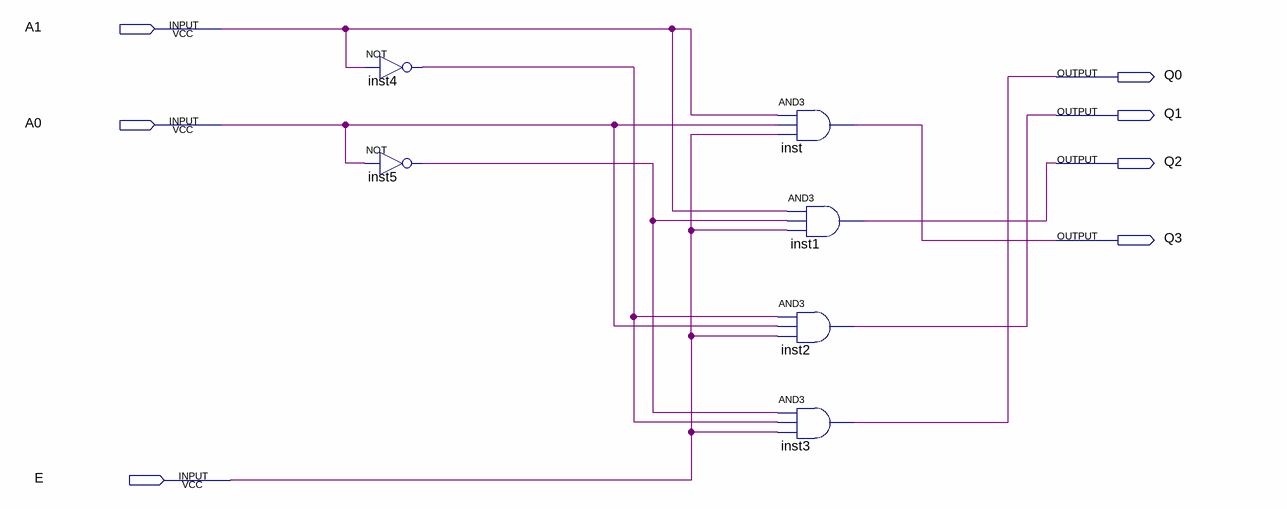
[diagram p0: schematic sheet]
// Quartus schematic Decoder2_4.bdf as structural Verilog: 6 symbols, 7 pins
module Decoder2_4 (
  input  A1,
  input  A0,
  input  E,
  output Q0,
  output Q1,
  output Q2,
  output Q3
);

  wire inst4_out, inst5_out;

  not inst4 (inst4_out, A1);
  not inst5 (inst5_out, A0);
  and inst (Q3, A1, A0, E);
  and inst2 (Q1, inst4_out, A0, E);
  and inst3 (Q0, inst5_out, inst4_out, E);
  and inst1 (Q2, A1, inst5_out, E);
endmodule
